# Altium schematic sheet main.SchDoc
size A4
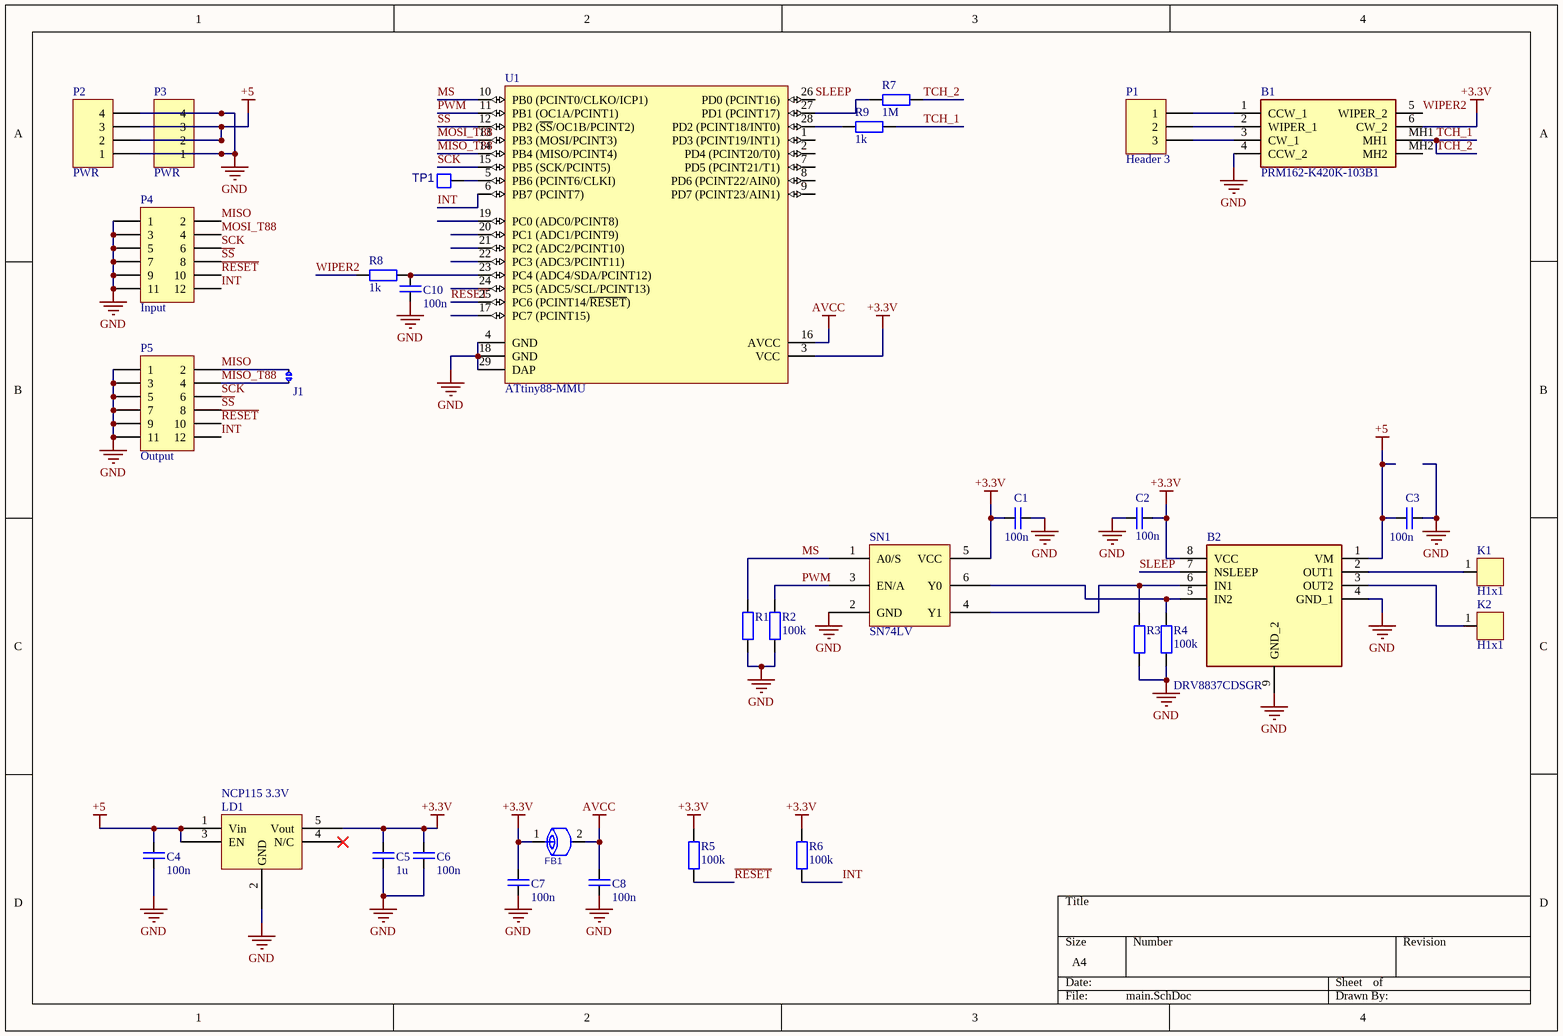
[diagram p0: main.SchDoc]

## Parts
B1  PRM162-K420K-103B1  [PRM162K415K103B1]
B2  DRV8837CDSGR  [SON50P200X200X80-9N]
C1  100n  [R1005_0402i_M]
C2  100n  [R1005_0402i_M]
C3  100n  [R1005_0402i_M]
C4  100n  [R1005_0402i_L]
C5  1u  [C1608_0603I_L]
C6  100n  [R1005_0402i_L]
C7  100n  [R1005_0402i_L]
C8  100n  [R1005_0402i_L]
C10  100n  [R1005_0402i_M]
FB1  FERITTE BEAD  [R1608_0603I_L]  (value not drawn)
J1  Terminator  [solderJumper]  (value not drawn)
K1  H1x1  [H1x1]
K2  H1x1  [H1x1]
LD1  NCP115 3.3V  [TSOP95P280X110-6L]
P1  Header 3  [HDR1X3]
P2  PWR  [HDR1X4]
P3  PWR  [HDR1X4]
P4  Input  [1.27mm SMD conn]
P5  Output  [1.27mm SMD conn]
R1  100k  [R1005_0402i_L]  (value not drawn)
R2  100k  [R1005_0402i_L]
R3  100k  [R1005_0402i_L]  (value not drawn)
R4  100k  [R1005_0402i_L]
R5  100k  [R1005_0402i_L]
R6  100k  [R1005_0402i_L]
R7  1M  [R1005_0402i_L]
R8  1k  [R1005_0402i_L]
R9  1k  [R1005_0402i_L]
SN1  SN74LV  [SON35P100X40-6N]
TP1  PAD  [PAD]  (value not drawn)
U1  ATtiny88-MMU  [28M1_N]

## Nets
+3.3V: B1.6(CW_2) B2.8(VCC) C1.2 C2.2 C5.1 C6.1 C7.1 FB1.1 LD1.5(Vout) R5.1 R6.1 SN1.5(VCC) U1.3(VCC)
+5: B2.1(VM) C3.1 C4.1 LD1.1(Vin) LD1.3(EN) P2.2 P2.3 P3.2 P3.3
AVCC: C8.1 FB1.2 U1.16(AVCC)
GND: B1.4(CCW_2) B2.4(GND_1) B2.9(GND_2) C1.1 C2.1 C3.2 C4.2 C5.2 C6.2 C7.2 C8.2 C10.2 LD1.2(GND) P2.1 P2.4 P3.1 P3.4 P4.1 P4.3 P4.5 P4.7 P4.9 P4.11 P5.1 P5.3 P5.5 P5.7 P5.9 P5.11 R1.2 R2.2 R3.2 R4.2 SN1.2(GND) U1.4(GND) U1.18(GND) U1.29(DAP)
INT: P4.12 P5.12 R6.2 U1.6(PB7_(PCINT7))
MISO: J1.2 P4.2 P5.2
MISO_T88: J1.1 P5.4 U1.14(PB4_(MISO/PCINT4))
MOSI_T88: P4.4 U1.13(PB3_(MOSI/PCINT3))
MS: R1.1 SN1.1(A0/S) U1.10(PB0_(PCINT0/CLKO/ICP1))
PWM: R2.1 SN1.3(EN/A) U1.11(PB1_(OC1A/PCINT1))
~{RESET}: P4.10 P5.10 R5.2 U1.25(PC6_(PCINT14/~{RESET}))
~{SS}: P4.8 P5.8 U1.12(PB2_(~{SS}/OC1B/PCINT2))
SCK: P4.6 P5.6 U1.15(PB5_(SCK/PCINT5))
SLEEP: B2.7(NSLEEP) U1.26(PD0_(PCINT16))
TCH_1: B1.MH1 R7.2 R9.2  [also labelled TCH_2]
WIPER2: B1.5(WIPER_2) R8.1
NetB1_1: B1.1(CCW_1) P1.1
NetB1_2: B1.2(WIPER_1) P1.2
NetB1_3: B1.3(CW_1) P1.3
NetB2_2: B2.2(OUT1) K1.1
NetB2_3: B2.3(OUT2) K2.1
NetB2_5: B2.5(IN2) R4.1 SN1.6(Y0)
NetB2_6: B2.6(IN1) R3.1 SN1.4(Y1)
NetC10_1: C10.1 R8.2 U1.23(PC4_(ADC4/SDA/PCINT12))
NetR7_1: R7.1 U1.27(PD1_(PCINT17))
NetR9_1: R9.1 U1.28(PD2_(PCINT18/INT0))
NetTP1_1: TP1.1 U1.5(PB6_(PCINT6/CLKI))

Not connected (* = marked no-connect by the designer): B1 MH2; LD1 4(N/C)*; U1 1(PD3_(PCINT19/INT1)) 2(PD4_(PCINT20/T0)) 7(PD5_(PCINT21/T1)) 8(PD6_(PCINT22/AIN0)) 9(PD7_(PCINT23/AIN1)) 17(PC7_(PCINT15)) 19(PC0_(ADC0/PCINT8)) 20(PC1_(ADC1/PCINT9)) 21(PC2_(ADC2/PCINT10)) 22(PC3_(ADC3/PCINT11)) 24(PC5_(ADC5/SCL/PCINT13))

## Library data of the parts
B1 = PRM162-K420K-103B1: Potentiometers 10KOHMS KNURLED DUAL NO DET; Manufacturer_Name: Bourns; Geometry.Height: 28.5mm; Mouser Part Number: 652-PRM162K420K103B1; Mouser Price/Stock: https://www.mouser.co.uk/ProductDetail/Bourns/PRM162-K420K-103B1?qs=U%2FacTlguYxaZbpiLvzzeCA%3D%3D; Manufacturer_Part_Number: PRM162-K420K-103B1; Datasheet Link: https://www.bourns.com/docs/product-datasheets/PDB18.pdf
B2 = DRV8837CDSGR: 1A Low-Voltage H-Bridge Driver; Manufacturer_Name: Texas Instruments; Geometry.Height: 0.8mm; Mouser Part Number: 595-DRV8837CDSGR; Mouser Price/Stock: https://www.mouser.co.uk/ProductDetail/Texas-Instruments/DRV8837CDSGR?qs=vcbl%252BK4rRlftuEtjGJGzZQ%3D%3D; Manufacturer_Part_Number: DRV8837CDSGR; Datasheet Link: http://www.ti.com/lit/gpn/drv8837c
C1-C8 C10 = C: Capacitor
J1 = JMP_mini
K1 K2 = H1x1: Header 1x1 (male)
P1 = Header 3: Header, 3-Pin; LatestRevisionDate: 17-Jul-2002; LatestRevisionNote: Re-released for DXP Platform.; Publisher: Altium Limited
P2 P3 = Header 4: Header, 4-Pin; LatestRevisionDate: 17-Jul-2002; LatestRevisionNote: Re-released for DXP Platform.; Publisher: Altium Limited
P4 P5 = Header 6X2: Header, 6-Pin, Dual row; LatestRevisionDate: 17-Jul-2002; LatestRevisionNote: Re-released for DXP Platform.; Publisher: Altium Limited
R1-R9 = R
U1 = ATtiny88-MMU: 8-bit AVR Microcontroller, 1.8-5.5V, 8KB Flash, 64 Bytes EEPROM, 512 Bytes SRAM, 28-pin MLF, Industrial Grade (-40°C to 85°C), Pb-Free; Published: 1-Apr-2010; DatasheetVersion: revC, Mar-2009; PackageVersion: revB, Nov-2008; PackageReference: 28M1; Publisher: Altium Limited; PackageDescription: 28-pad, 4x4x1.0mm Body, Pitch 0.45mm, 2.4x2.4mm Exposed Pad, Plastic Very Thin QFN Package (VQFN); Supplier 1: Digi-Key; Supplier Part Number 1: ATTINY88-MMU-ND; Supplier 2: Mouser; Supplier Part Number 2: 556-ATTINY88-MMU; ComponentLink1Description: Manufacturer Link; ComponentLink1URL: http://www.atmel.com/products/avr/default.asp?; ComponentLink2Description: ATtiny48/88 Datasheet; ComponentLink2URL: http://www.atmel.com/dyn/resources/prod_documents/doc8008.pdf; ComponentLink3Description: ATtiny48/88 Summary; ComponentLink3URL: http://www.atmel.com/dyn/resources/prod_documents/8008S.pdf; ComponentLink4Description: Atmel.com Home; ComponentLink4URL: http://www.atmel.com